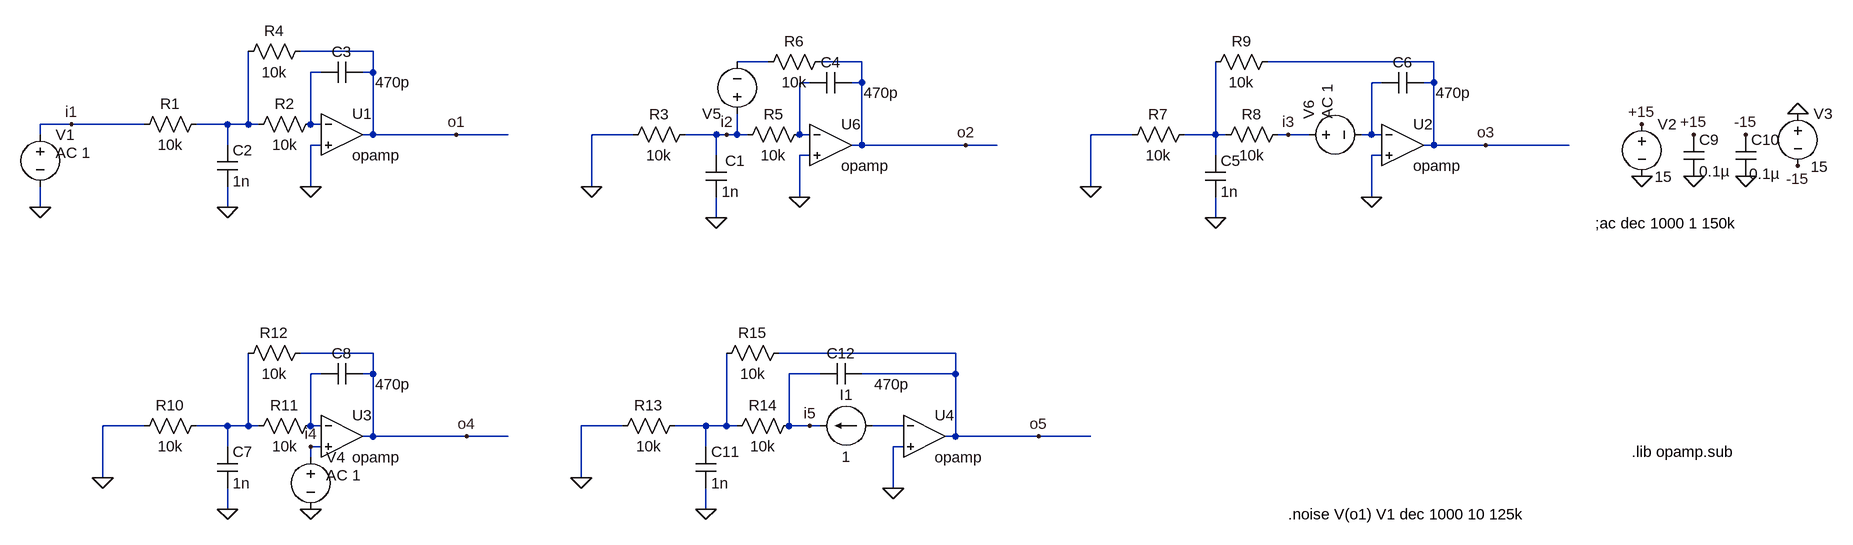
[diagram p0: schematic filtro ruido prueba.asc]
filtro ruido prueba.asc, the LTspice schematic file:
Version 4
SHEET 1 1900 680
WIRE -1616 -992 -1728 -992
WIRE -1008 -976 -1056 -976
WIRE -864 -976 -928 -976
WIRE 16 -976 -240 -976
WIRE -1696 -960 -1712 -960
WIRE -1616 -960 -1616 -992
WIRE -1616 -960 -1632 -960
WIRE -944 -944 -960 -944
WIRE -864 -944 -864 -976
WIRE -864 -944 -880 -944
WIRE -64 -944 -80 -944
WIRE 16 -944 16 -976
WIRE 16 -944 0 -944
WIRE -2080 -880 -2128 -880
WIRE -1968 -880 -2080 -880
WIRE -1840 -880 -1888 -880
WIRE -1808 -880 -1808 -992
WIRE -1808 -880 -1840 -880
WIRE -1792 -880 -1808 -880
WIRE -1712 -880 -1712 -960
WIRE -1696 -880 -1712 -880
WIRE -2128 -864 -2128 -880
WIRE -1616 -864 -1616 -960
WIRE -1616 -864 -1632 -864
WIRE -1488 -864 -1616 -864
WIRE -1408 -864 -1488 -864
WIRE -1216 -864 -1280 -864
WIRE -1088 -864 -1136 -864
WIRE -1072 -864 -1088 -864
WIRE -1056 -864 -1056 -896
WIRE -1056 -864 -1072 -864
WIRE -1040 -864 -1056 -864
WIRE -960 -864 -960 -944
WIRE -944 -864 -960 -864
WIRE -448 -864 -512 -864
WIRE -320 -864 -320 -976
WIRE -320 -864 -368 -864
WIRE -304 -864 -320 -864
WIRE -208 -864 -224 -864
WIRE -176 -864 -208 -864
WIRE -80 -864 -80 -944
WIRE -80 -864 -96 -864
WIRE -64 -864 -80 -864
WIRE -1840 -848 -1840 -880
WIRE -1696 -848 -1712 -848
WIRE -864 -848 -864 -944
WIRE -864 -848 -880 -848
WIRE -704 -848 -864 -848
WIRE -656 -848 -704 -848
WIRE 16 -848 16 -944
WIRE 16 -848 0 -848
WIRE 96 -848 16 -848
WIRE 224 -848 96 -848
WIRE -1088 -832 -1088 -864
WIRE -944 -832 -960 -832
WIRE -320 -832 -320 -864
WIRE -64 -832 -80 -832
WIRE -1712 -784 -1712 -848
WIRE -1280 -784 -1280 -864
WIRE -512 -784 -512 -864
WIRE -960 -768 -960 -832
WIRE -80 -768 -80 -832
WIRE -2128 -752 -2128 -784
WIRE -1840 -752 -1840 -784
WIRE -1088 -736 -1088 -768
WIRE -320 -736 -320 -768
WIRE -1616 -528 -1728 -528
WIRE -720 -528 -992 -528
WIRE -1696 -496 -1712 -496
WIRE -1616 -496 -1616 -528
WIRE -1616 -496 -1632 -496
WIRE -928 -496 -976 -496
WIRE -720 -496 -720 -528
WIRE -720 -496 -864 -496
WIRE -1968 -416 -2032 -416
WIRE -1840 -416 -1888 -416
WIRE -1808 -416 -1808 -528
WIRE -1808 -416 -1840 -416
WIRE -1792 -416 -1808 -416
WIRE -1712 -416 -1712 -496
WIRE -1696 -416 -1712 -416
WIRE -1232 -416 -1296 -416
WIRE -1104 -416 -1152 -416
WIRE -1072 -416 -1072 -528
WIRE -1072 -416 -1104 -416
WIRE -1056 -416 -1072 -416
WIRE -976 -416 -976 -496
WIRE -944 -416 -976 -416
WIRE -928 -416 -944 -416
WIRE -800 -416 -848 -416
WIRE -1616 -400 -1616 -496
WIRE -1616 -400 -1632 -400
WIRE -1472 -400 -1616 -400
WIRE -1408 -400 -1472 -400
WIRE -720 -400 -720 -496
WIRE -720 -400 -736 -400
WIRE -592 -400 -720 -400
WIRE -512 -400 -592 -400
WIRE -1840 -384 -1840 -416
WIRE -1696 -384 -1712 -384
WIRE -1104 -384 -1104 -416
WIRE -800 -384 -816 -384
WIRE -1712 -368 -1712 -384
WIRE -2032 -336 -2032 -416
WIRE -1296 -336 -1296 -416
WIRE -816 -320 -816 -384
WIRE -1840 -288 -1840 -320
WIRE -1104 -288 -1104 -320
FLAG -1712 -784 0
FLAG -1840 -752 0
FLAG 336 -880 +15
FLAG 576 -816 -15
FLAG -2128 -752 0
FLAG 496 -800 0
FLAG 416 -800 0
FLAG 336 -800 0
FLAG 576 -896 0
FLAG 416 -864 +15
FLAG 496 -864 -15
FLAG -960 -768 0
FLAG -1088 -736 0
FLAG -1280 -784 0
FLAG -80 -768 0
FLAG -320 -736 0
FLAG -512 -784 0
FLAG -1712 -288 0
FLAG -1840 -288 0
FLAG -2032 -336 0
FLAG -816 -320 0
FLAG -1104 -288 0
FLAG -1296 -336 0
FLAG -704 -848 o2
FLAG -1072 -864 i2
FLAG -1488 -864 o1
FLAG -2080 -880 i1
FLAG -208 -864 i3
FLAG -1712 -384 i4
FLAG -944 -416 i5
FLAG -592 -400 o5
FLAG -1472 -400 o4
FLAG 96 -848 o3
SYMBOL res -1984 -864 R270
WINDOW 0 32 56 VTop 2
WINDOW 3 0 56 VBottom 2
SYMATTR InstName R1
SYMATTR Value 10k
SYMBOL cap -1856 -848 R0
SYMATTR InstName C2
SYMATTR Value 1n
SYMBOL res -1808 -864 R270
WINDOW 0 32 56 VTop 2
WINDOW 3 0 56 VBottom 2
SYMATTR InstName R2
SYMATTR Value 10k
SYMBOL res -1824 -976 R270
WINDOW 0 32 56 VTop 2
WINDOW 3 0 56 VBottom 2
SYMATTR InstName R4
SYMATTR Value 10k
SYMBOL cap -1696 -944 R270
WINDOW 0 32 32 VTop 2
WINDOW 3 16 110 VBottom 2
SYMATTR InstName C3
SYMATTR Value 470p
SYMBOL voltage 336 -896 R0
WINDOW 123 24 124 Left 2
WINDOW 39 24 152 Left 2
WINDOW 3 20 97 Left 2
SYMATTR Value 15
SYMATTR InstName V2
SYMBOL voltage 576 -912 R0
WINDOW 123 24 124 Left 2
WINDOW 39 24 152 Left 2
WINDOW 3 20 97 Left 2
SYMATTR Value 15
SYMATTR InstName V3
SYMBOL voltage -2128 -880 R0
WINDOW 123 24 44 Left 2
WINDOW 39 0 0 Left 2
SYMATTR Value2 AC 1
SYMATTR InstName V1
SYMATTR Value ""
SYMBOL cap 400 -864 R0
SYMATTR InstName C9
SYMATTR Value 0.1µ
SYMBOL cap 480 -864 R0
WINDOW 3 21 60 Left 2
SYMATTR Value 0.1µ
SYMATTR InstName C10
SYMBOL res -1232 -848 R270
WINDOW 0 32 56 VTop 2
WINDOW 3 0 56 VBottom 2
SYMATTR InstName R3
SYMATTR Value 10k
SYMBOL cap -1104 -832 R0
WINDOW 0 30 8 Left 2
SYMATTR InstName C1
SYMATTR Value 1n
SYMBOL res -1056 -848 R270
WINDOW 0 32 56 VTop 2
WINDOW 3 0 56 VBottom 2
SYMATTR InstName R5
SYMATTR Value 10k
SYMBOL res -1024 -960 R270
WINDOW 0 32 56 VTop 2
WINDOW 3 0 56 VBottom 2
SYMATTR InstName R6
SYMATTR Value 10k
SYMBOL cap -944 -928 R270
WINDOW 0 32 32 VTop 2
WINDOW 3 16 110 VBottom 2
SYMATTR InstName C4
SYMATTR Value 470p
SYMBOL res -464 -848 R270
WINDOW 0 32 56 VTop 2
WINDOW 3 0 56 VBottom 2
SYMATTR InstName R7
SYMATTR Value 10k
SYMBOL cap -336 -832 R0
SYMATTR InstName C5
SYMATTR Value 1n
SYMBOL res -320 -848 R270
WINDOW 0 32 56 VTop 2
WINDOW 3 0 56 VBottom 2
SYMATTR InstName R8
SYMATTR Value 10k
SYMBOL res -336 -960 R270
WINDOW 0 32 56 VTop 2
WINDOW 3 0 56 VBottom 2
SYMATTR InstName R9
SYMATTR Value 10k
SYMBOL cap -64 -928 R270
WINDOW 0 32 32 VTop 2
WINDOW 3 16 110 VBottom 2
SYMATTR InstName C6
SYMATTR Value 470p
SYMBOL res -1984 -400 R270
WINDOW 0 32 56 VTop 2
WINDOW 3 0 56 VBottom 2
SYMATTR InstName R10
SYMATTR Value 10k
SYMBOL cap -1856 -384 R0
SYMATTR InstName C7
SYMATTR Value 1n
SYMBOL res -1808 -400 R270
WINDOW 0 32 56 VTop 2
WINDOW 3 0 56 VBottom 2
SYMATTR InstName R11
SYMATTR Value 10k
SYMBOL res -1824 -512 R270
WINDOW 0 32 56 VTop 2
WINDOW 3 0 56 VBottom 2
SYMATTR InstName R12
SYMATTR Value 10k
SYMBOL cap -1696 -480 R270
WINDOW 0 32 32 VTop 2
WINDOW 3 16 110 VBottom 2
SYMATTR InstName C8
SYMATTR Value 470p
SYMBOL res -1248 -400 R270
WINDOW 0 32 56 VTop 2
WINDOW 3 0 56 VBottom 2
SYMATTR InstName R13
SYMATTR Value 10k
SYMBOL cap -1120 -384 R0
SYMATTR InstName C11
SYMATTR Value 1n
SYMBOL res -1072 -400 R270
WINDOW 0 32 56 VTop 2
WINDOW 3 0 56 VBottom 2
SYMATTR InstName R14
SYMATTR Value 10k
SYMBOL res -1088 -512 R270
WINDOW 0 32 56 VTop 2
WINDOW 3 0 56 VBottom 2
SYMATTR InstName R15
SYMATTR Value 10k
SYMBOL cap -928 -480 R270
WINDOW 0 32 32 VTop 2
WINDOW 3 16 110 VBottom 2
SYMATTR InstName C12
SYMATTR Value 470p
SYMBOL voltage -1712 -384 R0
WINDOW 123 24 44 Left 2
WINDOW 39 0 0 Left 2
SYMATTR Value2 AC 1
SYMATTR InstName V4
SYMATTR Value ""
SYMBOL voltage -1056 -880 R180
WINDOW 123 24 44 Left 2
WINDOW 39 0 0 Left 2
SYMATTR InstName V5
SYMATTR Value ""
SYMBOL voltage -192 -864 R270
WINDOW 123 24 44 Left 2
WINDOW 39 0 0 Left 2
SYMATTR Value2 AC 1
SYMATTR InstName V6
SYMATTR Value ""
SYMBOL current -848 -416 R90
WINDOW 0 -32 40 VBottom 2
WINDOW 3 32 40 VTop 2
WINDOW 123 0 0 Left 2
WINDOW 39 0 0 Left 2
SYMATTR InstName I1
SYMATTR Value 1
SYMBOL Opamps\\opamp -912 -912 R0
SYMATTR InstName U6
SYMBOL Opamps\\opamp -1664 -928 R0
SYMATTR InstName U1
SYMBOL Opamps\\opamp -32 -912 R0
SYMATTR InstName U2
SYMBOL Opamps\\opamp -1664 -464 R0
SYMATTR InstName U3
SYMBOL Opamps\\opamp -768 -464 R0
SYMATTR InstName U4
TEXT 320 -376 Left 2 !.lib opamp.sub
TEXT 264 -728 Left 2 !;ac dec 1000 1 150k
TEXT -208 -280 Left 2 !.noise V(o1) V1 dec 1000 10 125k

The netlist it stands for:
* filtro ruido prueba.asc
R1 i1 N005 10k
C2 N005 0 1n
R2 N005 N002 10k
R4 N005 o1 10k
C3 N002 o1 470p
V2 +15 0 15
V3 0 -15 15
V1 i1 0 AC 1
C9 +15 0 0.1µ
C10 -15 0 0.1µ
R3 0 i2 10k
C1 i2 0 1n
R5 i2 N003 10k
R6 N001 o2 10k
C4 N003 o2 470p
R7 0 N006 10k
C5 N006 0 1n
R8 N006 i3 10k
R9 N006 o3 10k
C6 N004 o3 470p
R10 0 N008 10k
C7 N008 0 1n
R11 N008 N007 10k
R12 N008 o4 10k
C8 N007 o4 470p
R13 0 N009 10k
C11 N009 0 1n
R14 N009 i5 10k
R15 N009 o5 10k
C12 i5 o5 470p
V4 i4 0 AC 1
V5 i2 N001
V6 i3 N004 AC 1
I1 N010 i5 1
XU6 N003 0 o2 opamp Aol=100K GBW=10Meg  ; pins invin noninvin out
XU1 N002 0 o1 opamp Aol=100K GBW=10Meg  ; pins invin noninvin out
XU2 N004 0 o3 opamp Aol=100K GBW=10Meg  ; pins invin noninvin out
XU3 N007 i4 o4 opamp Aol=100K GBW=10Meg  ; pins invin noninvin out
XU4 N010 0 o5 opamp Aol=100K GBW=10Meg  ; pins invin noninvin out
.lib opamp.sub
;ac dec 1000 1 150k
.noise V(o1) V1 dec 1000 10 125k
.backanno
.end